# EAGLE design armBandHeaderShield (EAGLE 9.3.1)
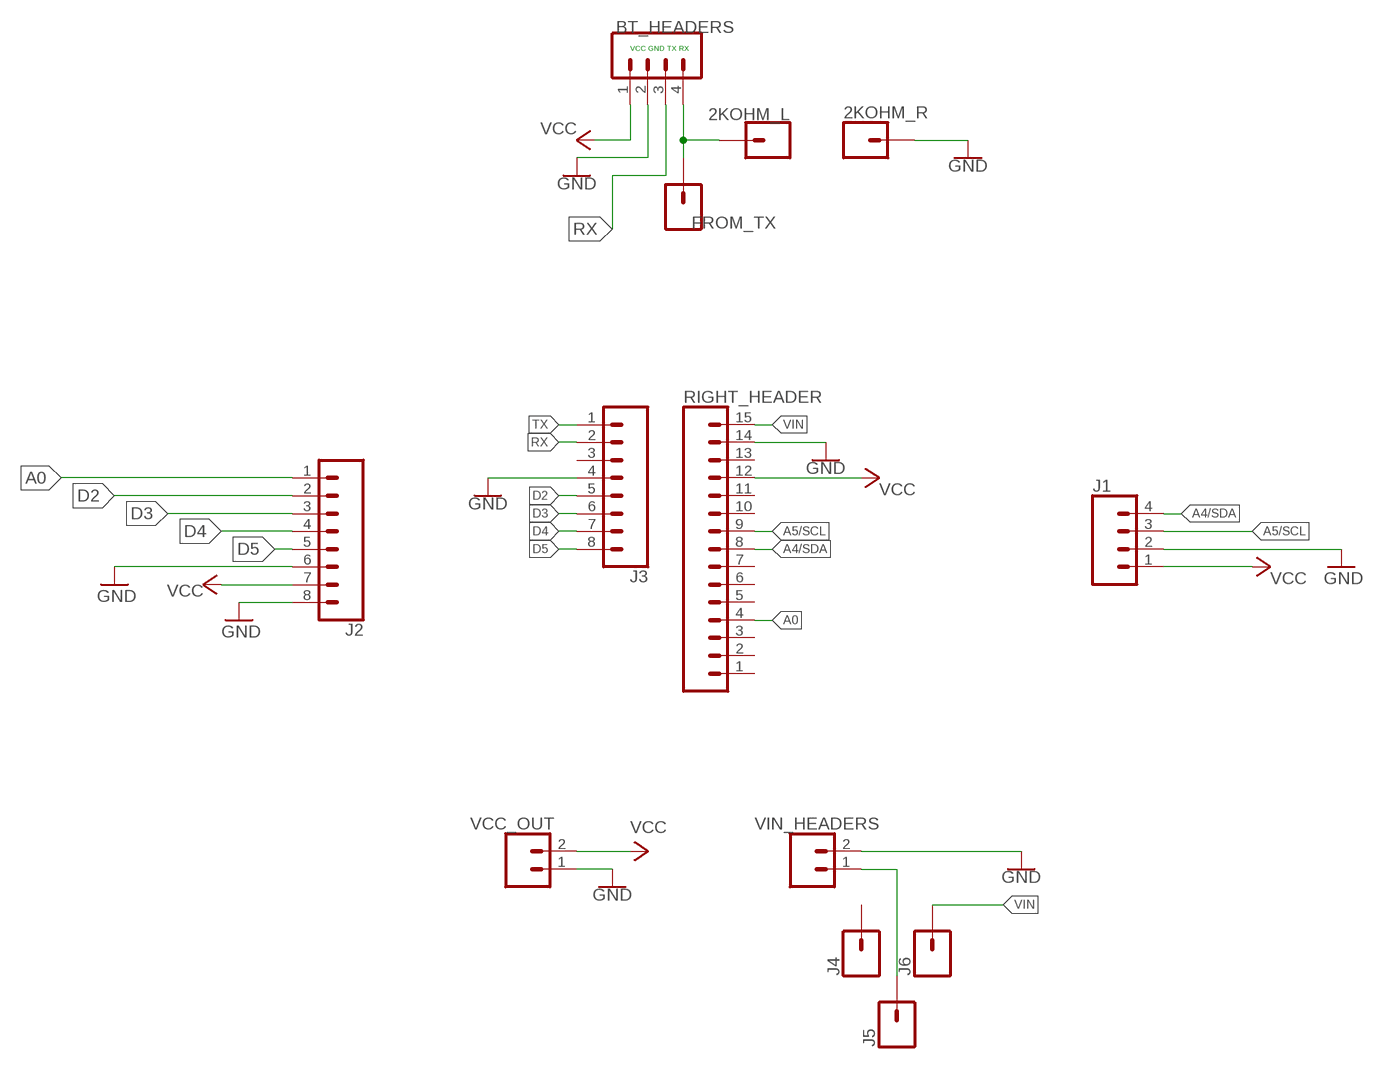
[diagram p0: schematic, sheet 1]

## Parts
2KOHM_L  CONN_01  [1X01]
2KOHM_R  CONN_01  [1X01]
BT_HEADERS  CONN_04  [1X04]
FROM_TX  CONN_01  [1X01]
J1  CONN_04  [1X04]
J2  CONN_08"  [1X08]
J3  CONN_08"  [1X08]
J4  CONN_01  [1X01]
J5  CONN_01  [1X01]
J6  CONN_01  [1X01]
RIGHT_HEADER  CONN_15  [1X15]
VCC_OUT  CONN_02PTH3  [1X02_LONGPADS]
VIN_HEADERS  CONN_02PTH3  [1X02_LONGPADS]

## Nets
A0: J2.1 RIGHT_HEADER.4
A4/SDA: J1.4 RIGHT_HEADER.8
A5/SCL: J1.3 RIGHT_HEADER.9
D2: J2.2 J3.5
D3: J2.3 J3.6
D4: J2.4 J3.7
D5: J2.5 J3.8
GND: 2KOHM_R.1 BT_HEADERS.2 J1.2 J2.6 J2.8 J3.4 RIGHT_HEADER.14 VCC_OUT.1 VIN_HEADERS.2
N$1: J5.1 VIN_HEADERS.1
N$7: 2KOHM_L.1 BT_HEADERS.4 FROM_TX.1
RX: BT_HEADERS.3 J3.2
TX: J3.1
VCC: BT_HEADERS.1 J1.1 J2.7 RIGHT_HEADER.12 VCC_OUT.2
VIN: J6.1 RIGHT_HEADER.15
Unconnected: J3.3 J4.1 RIGHT_HEADER.1 RIGHT_HEADER.2 RIGHT_HEADER.3 RIGHT_HEADER.5 RIGHT_HEADER.6 RIGHT_HEADER.7 RIGHT_HEADER.10 RIGHT_HEADER.11 RIGHT_HEADER.13

## Notes on the sheet
- VCC GND TX RX

## Library data of the parts
2KOHM_L 2KOHM_R FROM_TX J4-J6 = SparkFun-Connectors:CONN_01: Single connection point. Often used as Generic Header-pin footprint for 0.1 inch spaced/style header connections On any of the 0.1 inch spaced packages, you can populate with these: Break Away Headers - Straight <https://www.sparkfun.com/products/116> (PRT-00116) Break Away Male Headers - Right Angle <https://www.sparkfun.com/products/553> (PRT-00553) Female Headers <https://www.sparkfun.com/products/115> (PRT-00115) Break Away Headers - Machine Pin <https://www.sparkfun.com/products/117> (PRT-00117) Break Away Female Headers - Swiss Machine Pin <https://www.sparkfun.com/products/743> (PRT-00743) This device is also useful as a general connection point to wire up your design to another part of your project. Our various solder wires solder well into these plated through hole pads. Hook-Up Wire - Assortment (Stranded, 22 AWG) <https://www.sparkfun.com/products/11375> (PRT-11375) Hook-Up Wire - Assortment (Solid Core, 22 AWG) <https://www.sparkfun.com/products/11367> (PRT-11367) View the entire wire category on our website here <https://www.sparkfun.com/categories/141> Special notes: SMTSO-256-ET is a "flush mount" nut for a 4-40 screw. We mostly use this on specialty testbeds; it is a nice way to connect hardware to your PCB at an adjustable hieght. Also note, the SNAP packages are for using a snappable style connector. We sell a baggie of snaps and they are also used on two LilyPad designs: Snap Assortment - 30 pack (male and female) <https://www.sparkfun.com/products/11347> (DEV-11347) LilyPad Arduino SimpleSnap <https://www.sparkfun.com/products/10941> (DEV-10941) LilyPad SimpleSnap Protoboard <https://www.sparkfun.com/products/10940> (DEV-10940)
BT_HEADERS J1 = SparkFun-Connectors:CONN_04: Multi connection point. Often used as Generic Header-pin footprint for 0.1 inch spaced/style header connections On any of the 0.1 inch spaced packages, you can populate with these: Break Away Headers - Straight <https://www.sparkfun.com/products/116> (PRT-00116) Break Away Male Headers - Right Angle <https://www.sparkfun.com/products/553> (PRT-00553) Female Headers <https://www.sparkfun.com/products/115> (PRT-00115) Break Away Headers - Machine Pin <https://www.sparkfun.com/products/117> (PRT-00117) Break Away Female Headers - Swiss Machine Pin <https://www.sparkfun.com/products/743> (PRT-00743) For SCREWTERMINALS and SPRING TERMINALS visit here: Screw Terimnals on SparkFun.com <https://www.sparkfun.com/search/results?term=Screw+Terminals> (5mm/3.5mm/2.54mm spacing) This device is also useful as a general connection point to wire up your design to another part of your project. Our various solder wires solder well into these plated through hole pads. Hook-Up Wire - Assortment (Stranded, 22 AWG) <https://www.sparkfun.com/products/11375> (PRT-11375) Hook-Up Wire - Assortment (Solid Core, 22 AWG) <https://www.sparkfun.com/products/11367> (PRT-11367) View the entire wire category on our website here <https://www.sparkfun.com/categories/141> Special notes: Molex polarized connector foot print use with SKU : PRT-08231 with associated crimp pins and housings. 1MM SMD Version SKU: PRT-10208; PROD_ID: CONN-09696
J2 J3 = SparkFun-Connectors:CONN_08: Multi connection point. Often used as Generic Header-pin footprint for 0.1 inch spaced/style header connections On any of the 0.1 inch spaced packages, you can populate with these: Break Away Headers - Straight <https://www.sparkfun.com/products/116> (PRT-00116) Break Away Male Headers - Right Angle <https://www.sparkfun.com/products/553> (PRT-00553) Female Headers <https://www.sparkfun.com/products/115> (PRT-00115) Break Away Headers - Machine Pin <https://www.sparkfun.com/products/117> (PRT-00117) Break Away Female Headers - Swiss Machine Pin <https://www.sparkfun.com/products/743> (PRT-00743) Arduino Stackable Header - 8 Pin <https://www.sparkfun.com/products/9279> (PRT-09279) For SCREWTERMINALS and SPRING TERMINALS visit here: Screw Terimnals on SparkFun.com <https://www.sparkfun.com/search/results?term=Screw+Terminals> (5mm/3.5mm/2.54mm spacing) This device is also useful as a general connection point to wire up your design to another part of your project. Our various solder wires solder well into these plated through hole pads. Hook-Up Wire - Assortment (Stranded, 22 AWG) <https://www.sparkfun.com/products/11375> (PRT-11375) Hook-Up Wire - Assortment (Solid Core, 22 AWG) <https://www.sparkfun.com/products/11367> (PRT-11367) View the entire wire category on our website here <https://www.sparkfun.com/categories/141> Special notes: Molex polarized connector foot print use with SKU : PRT-08231 with associated crimp pins and housings. 1MM SMD Version SKU: PRT-10208 NOTES ON THE VARIANTS LOCK and LOCK_LONGPADS... This footprint was designed to help hold the alignment of a through-hole component (i.e. 6-pin header) while soldering it into place. You may notice that each hole has been shifted either up or down by 0.005 of an inch from it's more standard position (which is a perfectly straight line). This slight alteration caused the pins (the squares in the middle) to touch the edges of the holes. Because they are alternating, it causes a "brace" to hold the component in place. 0.005 has proven to be the perfect amount of "off-center" position when using our standard breakaway headers. Although looks a little odd when you look at the bare footprint, once you have a header in there, the alteration is very hard to notice. Also,if you push a header all the way into place, it is covered up entirely on the bottom side.; PROD_ID: CONN-08438
RIGHT_HEADER = SparkFun-Connectors:CONN_15: Multi connection point. Often used as Generic Header-pin footprint for 0.1 inch spaced/style header connections On any of the 0.1 inch spaced packages, you can populate with these: Break Away Headers - Straight <https://www.sparkfun.com/products/116> (PRT-00116) Break Away Male Headers - Right Angle <https://www.sparkfun.com/products/553> (PRT-00553) Female Headers <https://www.sparkfun.com/products/115> (PRT-00115) Break Away Headers - Machine Pin <https://www.sparkfun.com/products/117> (PRT-00117) Break Away Female Headers - Swiss Machine Pin <https://www.sparkfun.com/products/743> (PRT-00743) For SCREWTERMINALS and SPRING TERMINALS visit here: Screw Terimnals on SparkFun.com <https://www.sparkfun.com/search/results?term=Screw+Terminals> (5mm/3.5mm/2.54mm spacing) This device is also useful as a general connection point to wire up your design to another part of your project. Our various solder wires solder well into these plated through hole pads. Hook-Up Wire - Assortment (Stranded, 22 AWG) <https://www.sparkfun.com/products/11375> (PRT-11375) Hook-Up Wire - Assortment (Solid Core, 22 AWG) <https://www.sparkfun.com/products/11367> (PRT-11367) View the entire wire category on our website here <https://www.sparkfun.com/categories/141> Special notes: Molex polarized connector foot print use with SKU : PRT-08231 with associated crimp pins and housings. 1MM SMD Version SKU: PRT-10208 NOTES ON THE VARIANTS LOCK and LOCK_LONGPADS... This footprint was designed to help hold the alignment of a through-hole component (i.e. 6-pin header) while soldering it into place. You may notice that each hole has been shifted either up or down by 0.005 of an inch from it's more standard position (which is a perfectly straight line). This slight alteration caused the pins (the squares in the middle) to touch the edges of the holes. Because they are alternating, it causes a "brace" to hold the component in place. 0.005 has proven to be the perfect amount of "off-center" position when using our standard breakaway headers. Although looks a little odd when you look at the bare footprint, once you have a header in there, the alteration is very hard to notice. Also,if you push a header all the way into place, it is covered up entirely on the bottom side.
VCC_OUT VIN_HEADERS = SparkFun-Connectors:CONN_02: Multi connection point. Often used as Generic Header-pin footprint for 0.1 inch spaced/style header connections On any of the 0.1 inch spaced packages, you can populate with these: Break Away Headers - Straight <https://www.sparkfun.com/products/116> (PRT-00116) Break Away Male Headers - Right Angle <https://www.sparkfun.com/products/553> (PRT-00553) Female Headers <https://www.sparkfun.com/products/115> (PRT-00115) Break Away Headers - Machine Pin <https://www.sparkfun.com/products/117> (PRT-00117) Break Away Female Headers - Swiss Machine Pin <https://www.sparkfun.com/products/743> (PRT-00743) For SCREWTERMINALS and SPRING TERMINALS visit here: Screw Terimnals on SparkFun.com <https://www.sparkfun.com/search/results?term=Screw+Terminals> (5mm/3.5mm/2.54mm spacing) This device is also useful as a general connection point to wire up your design to another part of your project. Our various solder wires solder well into these plated through hole pads. Hook-Up Wire - Assortment (Stranded, 22 AWG) <https://www.sparkfun.com/products/11375> (PRT-11375) Hook-Up Wire - Assortment (Solid Core, 22 AWG) <https://www.sparkfun.com/products/11367> (PRT-11367) View the entire wire category on our website here <https://www.sparkfun.com/categories/141> Special notes: Molex polarized connector foot print use with: PRT-08233 with associated crimp pins and housings. 2.54_SCREWTERM for use with PRT-10571. 3.5mm Screw Terminal footprints for PRT-08084 5mm Screw Terminal footprints for use with PRT-08432

## Net classes
0 default: width 0.508 mm, drill 0.508 mm, clearance 0.508 mm

## Board
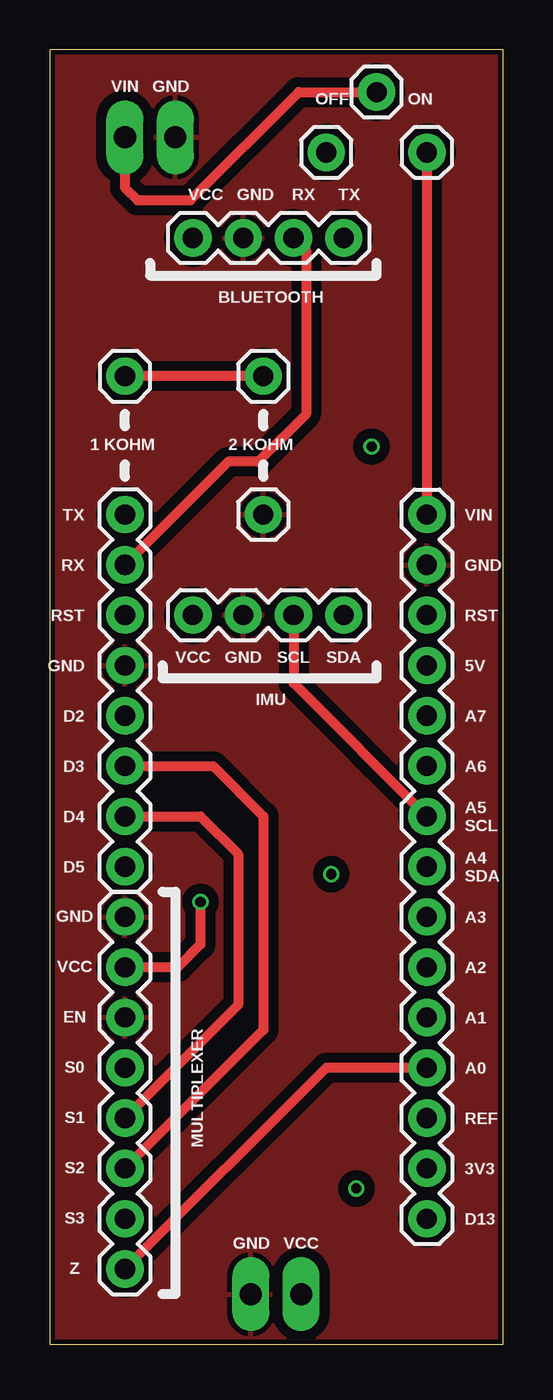
[diagram p1: board, top side]
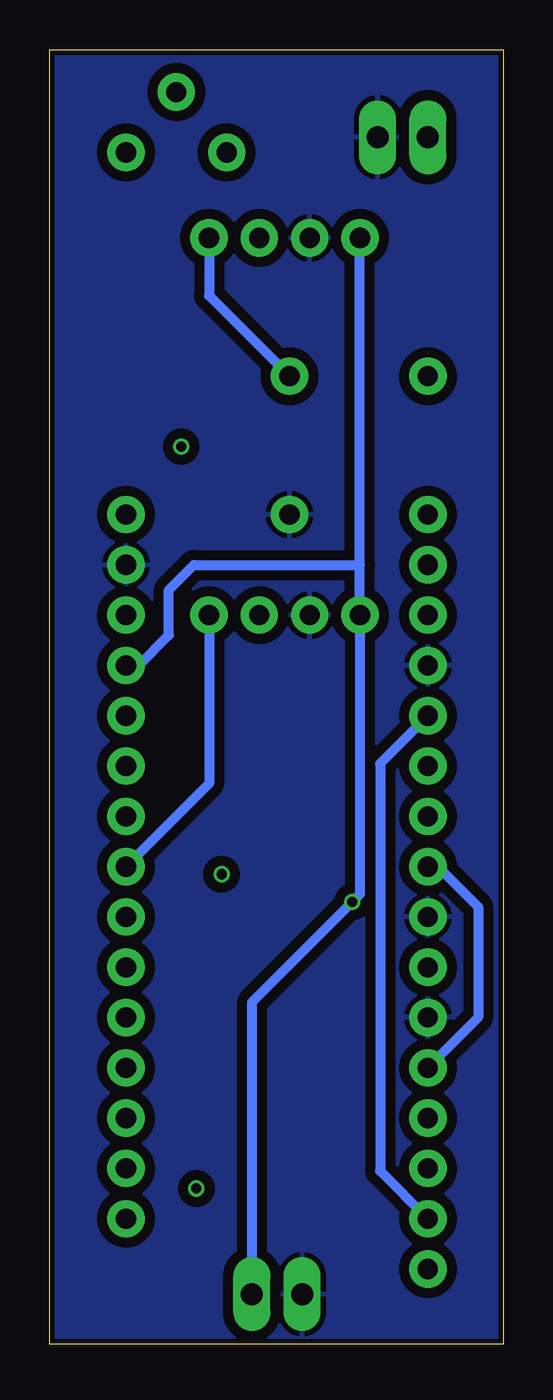
[diagram p2: board, bottom side, seen from below]

Size 22.91 x 65.39 mm. Coordinates in mm from the lower left corner, seen from the top.
Outline: 0,0 22.91,0 22.91,65.39 0,65.39 0,0
Copper layers (1*16): Top 0.035mm / dielectric 1.5mm / Bottom 0.035mm
Design rules "SeeedStudio_2layer_DRU_no_angle_20140221": minimum track width 6mil, minimum drill 12mil, track to track 6mil, track to pad 6mil, pad to pad 6mil, via to via 6mil, smd to smd 0mil, copper to edge 10mil, drill to drill 10mil, minimum pad ring 10mil, minimum via ring 6mil, stop-mask expansion 2mil, vias tented up to drill 100mil, thermal gap 10mil

### Footprints (pad centres in the part's own frame; a part is rotated, then mirrored left to right if it is on the bottom)
1X01 = drill 1.016 pad 1.88: 1 0,0
1X04 = drill 1.016 pad 1.88: 1 0,0; 2 2.54,0; 3 5.08,0; 4 7.62,0
1X08 = drill 1.016 pad 1.88: 1 0,0; 2 2.54,0; 3 5.08,0; 4 7.62,0; 5 10.16,0; 6 12.7,0; 7 15.24,0; 8 17.78,0
1X15 = drill 1.016 pad 1.88: 1 0,0; 2 2.54,0; 3 5.08,0; 4 7.62,0; 5 10.16,0; 6 12.7,0; 7 15.24,0; 8 17.78,0; 9 20.32,0; 10 22.86,0; 11 25.4,0; 12 27.94,0; 13 30.48,0; 14 33.02,0; 15 35.56,0
1X02_LONGPADS = drill 1.118 pad 1.88 long: 1 0,0; 2 2.54,0

### Placement (x,y rotation side)
2KOHM_L  10.79,48.9 0 top
2KOHM_R  10.79,41.91 0 top
BT_HEADERS  7.24,55.88 0 top
FROM_TX  3.81,48.9 0 top
J1  7.24,36.83 0 top
J2  3.81,3.81 90 top
J3  3.81,41.91 270 top
J4  13.97,60.2 0 top
J5  16.51,63.25 0 top
J6  19.05,60.2 0 top
RIGHT_HEADER  19.05,6.35 90 top
VCC_OUT  10.16,2.54 0 top
VIN_HEADERS  3.81,60.96 0 top

### Tracks (layer width: path | path; a pad name or v marks a point on that pad's centre or on a via)
A0
  Top 0.508: J2.1 13.97,13.97 RIGHT_HEADER.4
A4/SDA
  Bottom 0.508: RIGHT_HEADER.8 14.86,28.32 J1.4
A5/SCL
  Top 0.508: RIGHT_HEADER.9 12.32,33.4 J1.3
D2
  Bottom 0.508: J2.2 6.22,8.76 6.22,29.34 J3.5
D3
  Top 0.508: J3.6 8.26,29.21 10.79,26.67 10.79,15.88 J2.3
D4
  Top 0.508: J3.7 7.62,26.67 9.53,24.77 9.53,17.14 J2.4
D5
  Bottom 0.508: J2.5 1.27,16.51 1.27,22.1 3.3,24.13 J3.8
GND
  pour Top: -1.27,66.04 -1.27,-1.27 24.13,-1.27 24.13,66.04
  pour Bottom: -1.91,66.67 -1.91,-1.91 24.77,-1.91 24.77,66.67
N$1
  Top 0.508: J5.1 12.57,63.25 7.11,57.78 4.45,57.78 3.81,58.42 VIN_HEADERS.1
N$2  (via drill 0.51)
  other vias: 16.26,45.34
N$3  (via drill 0.51)
  other vias: 15.49,7.87
N$4  (via drill 0.51)
  other vias: 14.22,23.75
N$7
  Top 0.508: 2KOHM_L.1 FROM_TX.1
  Bottom 0.508: BT_HEADERS.4 14.86,52.96 2KOHM_L.1
RX
  Top 0.508: J3.2 9.02,44.58 10.54,44.58 12.95,46.99 12.95,55.24 BT_HEADERS.3
VCC  (via drill 0.51)
  Top 0.508: v7.62,22.35 7.62,20.19 6.48,19.05 J2.7
  Bottom 0.508: 7.24,39.37 J1.1 7.24,22.73 v7.62,22.35 12.7,17.27 VCC_OUT.2 | 7.24,39.37 BT_HEADERS.1 | RIGHT_HEADER.12 18.41,34.29 16.89,35.81 16.89,38.1 15.62,39.37 7.24,39.37
VIN
  Top 0.508: J6.1 RIGHT_HEADER.15

### Text on the board
tNames: VIN GND | OFF ON | VCC GND RX TX | BLUETOOTH | 1 KOHM | 2 KOHM | TX | VIN | RX | GND | RST | RST | GND | VCC | GND | SCL | SDA | 5V | IMU | D2 | A7 | D3 | A6 | D4 | A5 / SCL | D5 | A4 / SDA | A3 | GND | VCC | A2 | A1 | EN | S0 | A0 | MULTIPLEXER | S1 | REF | S2 | 3V3 | S3 | D13 | GND VCC | Z